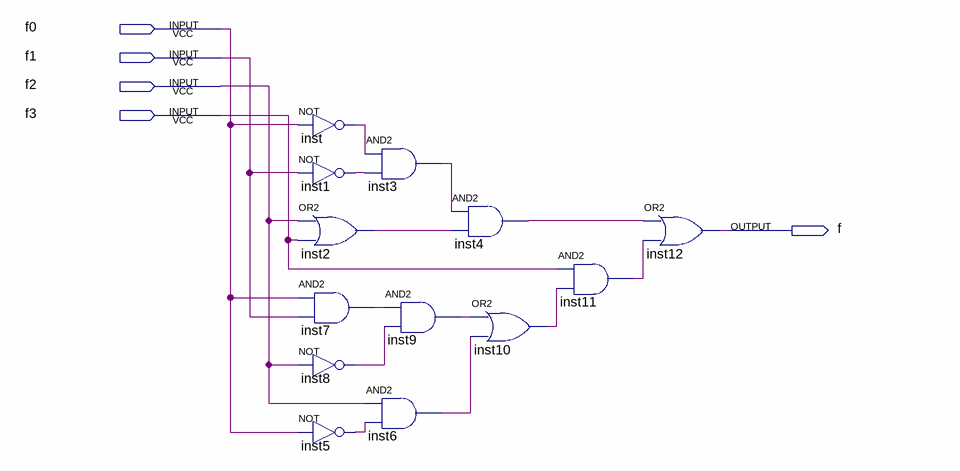
[diagram p0: schematic sheet]
// Quartus schematic f_segment.bdf as structural Verilog: 13 symbols, 5 pins
module f_segment (
  input  f0,
  input  f1,
  input  f2,
  input  f3,
  output f
);

  wire inst1_out, inst2_out, inst3_out, inst4_out, inst5_out, inst6_out, inst7_out, inst8_out, inst9_out,
       inst10_out, inst11_out, inst_out;

  not inst (inst_out, f0);
  not inst1 (inst1_out, f1);
  or inst2 (inst2_out, f2, f3);
  and inst7 (inst7_out, f0, f1);
  not inst8 (inst8_out, f2);
  not inst5 (inst5_out, f0);
  and inst3 (inst3_out, inst_out, inst1_out);
  and inst9 (inst9_out, inst7_out, inst8_out);
  and inst6 (inst6_out, f2, inst5_out);
  and inst4 (inst4_out, inst3_out, inst2_out);
  or inst10 (inst10_out, inst9_out, inst6_out);
  and inst11 (inst11_out, f3, inst10_out);
  or inst12 (f, inst4_out, inst11_out);
endmodule
